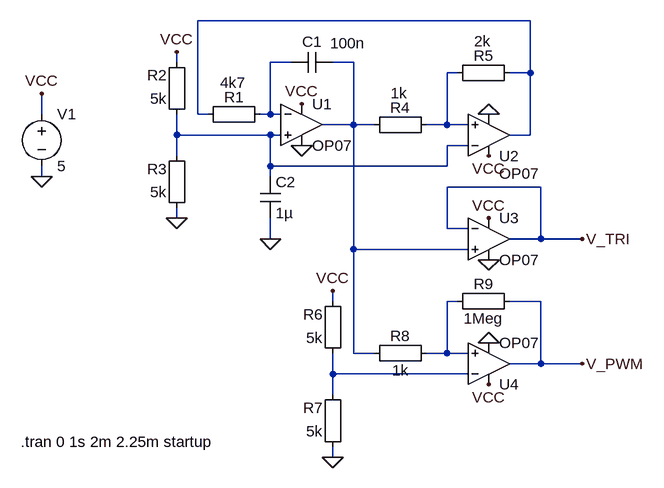
[diagram p0: schematic WFG.asc]
WFG.asc, the LTspice schematic file:
Version 4.1
SHEET 1 880 680
WIRE 560 -16 48 -16
WIRE 16 48 16 32
WIRE 192 48 160 48
WIRE 288 48 256 48
WIRE 448 64 432 64
WIRE 560 64 560 -16
WIRE 560 64 528 64
WIRE -192 128 -192 96
WIRE 48 128 48 -16
WIRE 64 128 48 128
WIRE 160 128 160 48
WIRE 160 128 144 128
WIRE 176 128 160 128
WIRE 288 144 288 48
WIRE 288 144 240 144
WIRE 320 144 288 144
WIRE 432 144 432 64
WIRE 432 144 400 144
WIRE 464 144 432 144
WIRE 16 160 16 128
WIRE 160 160 16 160
WIRE 176 160 160 160
WIRE 560 160 560 64
WIRE 560 160 528 160
WIRE 464 176 432 176
WIRE 16 192 16 160
WIRE 160 208 160 160
WIRE 432 208 432 176
WIRE 432 208 160 208
WIRE -192 224 -192 208
WIRE 160 224 160 208
WIRE 576 240 432 240
WIRE 16 288 16 272
WIRE 432 304 432 240
WIRE 464 304 432 304
WIRE 160 320 160 288
WIRE 576 320 576 240
WIRE 576 320 528 320
WIRE 640 320 576 320
WIRE 288 336 288 144
WIRE 464 336 288 336
WIRE 256 416 256 400
WIRE 448 416 432 416
WIRE 576 416 528 416
WIRE 288 496 288 336
WIRE 320 496 288 496
WIRE 432 496 432 416
WIRE 432 496 400 496
WIRE 464 496 432 496
WIRE 576 512 576 416
WIRE 576 512 528 512
WIRE 640 512 576 512
WIRE 256 528 256 496
WIRE 464 528 256 528
WIRE 256 560 256 528
WIRE 256 656 256 640
FLAG -192 96 VCC
FLAG -192 224 0
FLAG 208 112 VCC
FLAG 208 176 0
FLAG 16 32 VCC
FLAG 16 288 0
FLAG 160 320 0
FLAG 496 288 VCC
FLAG 496 352 0
FLAG 640 320 V_TRI
FLAG 496 544 VCC
FLAG 496 480 0
FLAG 256 400 VCC
FLAG 256 656 0
FLAG 640 512 V_PWM
FLAG 496 192 VCC
FLAG 496 128 0
SYMBOL OpAmps\\OP07 208 80 R0
SYMATTR InstName U1
SYMBOL Misc\\EuropeanResistor 160 112 R90
WINDOW 0 5 56 VBottom 2
WINDOW 3 -48 58 VTop 2
SYMATTR InstName R1
SYMATTR Value 4k7
SYMBOL cap 256 32 R90
WINDOW 0 0 32 VBottom 2
WINDOW 3 -29 -23 VTop 2
SYMATTR InstName C1
SYMATTR Value 100n
SYMBOL voltage -192 112 R0
SYMATTR InstName V1
SYMATTR Value 5
SYMBOL Misc\\EuropeanResistor 32 144 R180
WINDOW 0 31 76 Left 2
WINDOW 3 31 40 Left 2
SYMATTR InstName R2
SYMATTR Value 5k
SYMBOL Misc\\EuropeanResistor 32 288 R180
WINDOW 0 31 76 Left 2
WINDOW 3 31 40 Left 2
SYMATTR InstName R3
SYMATTR Value 5k
SYMBOL cap 144 224 R0
SYMATTR InstName C2
SYMATTR Value 1µ
SYMBOL Misc\\EuropeanResistor 416 128 R90
WINDOW 0 5 56 VBottom 2
WINDOW 3 -48 58 VTop 2
SYMATTR InstName R4
SYMATTR Value 1k
SYMBOL OpAmps\\OP07 496 224 M180
WINDOW 3 16 5 Left 2
SYMATTR InstName U2
SYMBOL Misc\\EuropeanResistor 544 48 R90
WINDOW 0 5 56 VBottom 2
WINDOW 3 -48 58 VTop 2
SYMATTR InstName R5
SYMATTR Value 2k
SYMBOL OpAmps\\OP07 496 256 R0
SYMATTR InstName U3
SYMBOL OpAmps\\OP07 496 576 M180
SYMATTR InstName U4
SYMBOL Misc\\EuropeanResistor 272 512 R180
WINDOW 0 31 76 Left 2
WINDOW 3 31 40 Left 2
SYMATTR InstName R6
SYMATTR Value 5k
SYMBOL Misc\\EuropeanResistor 272 656 R180
WINDOW 0 31 76 Left 2
WINDOW 3 31 40 Left 2
SYMATTR InstName R7
SYMATTR Value 5k
SYMBOL Misc\\EuropeanResistor 304 512 R270
WINDOW 0 27 56 VTop 2
WINDOW 3 5 56 VBottom 2
SYMATTR InstName R8
SYMATTR Value 1k
SYMBOL Misc\\EuropeanResistor 432 432 R270
WINDOW 0 27 56 VTop 2
WINDOW 3 5 56 VBottom 2
SYMATTR InstName R9
SYMATTR Value 1Meg
TEXT -224 632 Left 2 !.tran 0 1s 2m 2.25m startup

The netlist it stands for:
* WFG.asc
X§U1 N005 N002 VCC 0 N003 LT1001  ; OP07, pins In+ In- V+ V- OUT
R1 N002 N001 4k7
C1 N003 N002 100n
V1 VCC 0 5
R2 N005 VCC 5k
R3 0 N005 5k
C2 N005 0 1µ
R4 N004 N003 1k
X§U2 N004 N005 VCC 0 N001 LT1001  ; OP07, pins In+ In- V+ V- OUT
R5 N001 N004 2k
X§U3 N003 V_TRI VCC 0 V_TRI LT1001  ; OP07, pins In+ In- V+ V- OUT
X§U4 N006 N007 VCC 0 V_PWM LT1001  ; OP07, pins In+ In- V+ V- OUT
R6 N007 VCC 5k
R7 0 N007 5k
R8 N003 N006 1k
R9 N006 V_PWM 1Meg
.tran 0 1s 2m 2.25m startup
.lib LTC.lib
.backanno
.end